# Altium schematic sheet edl_final.SchDoc
size E
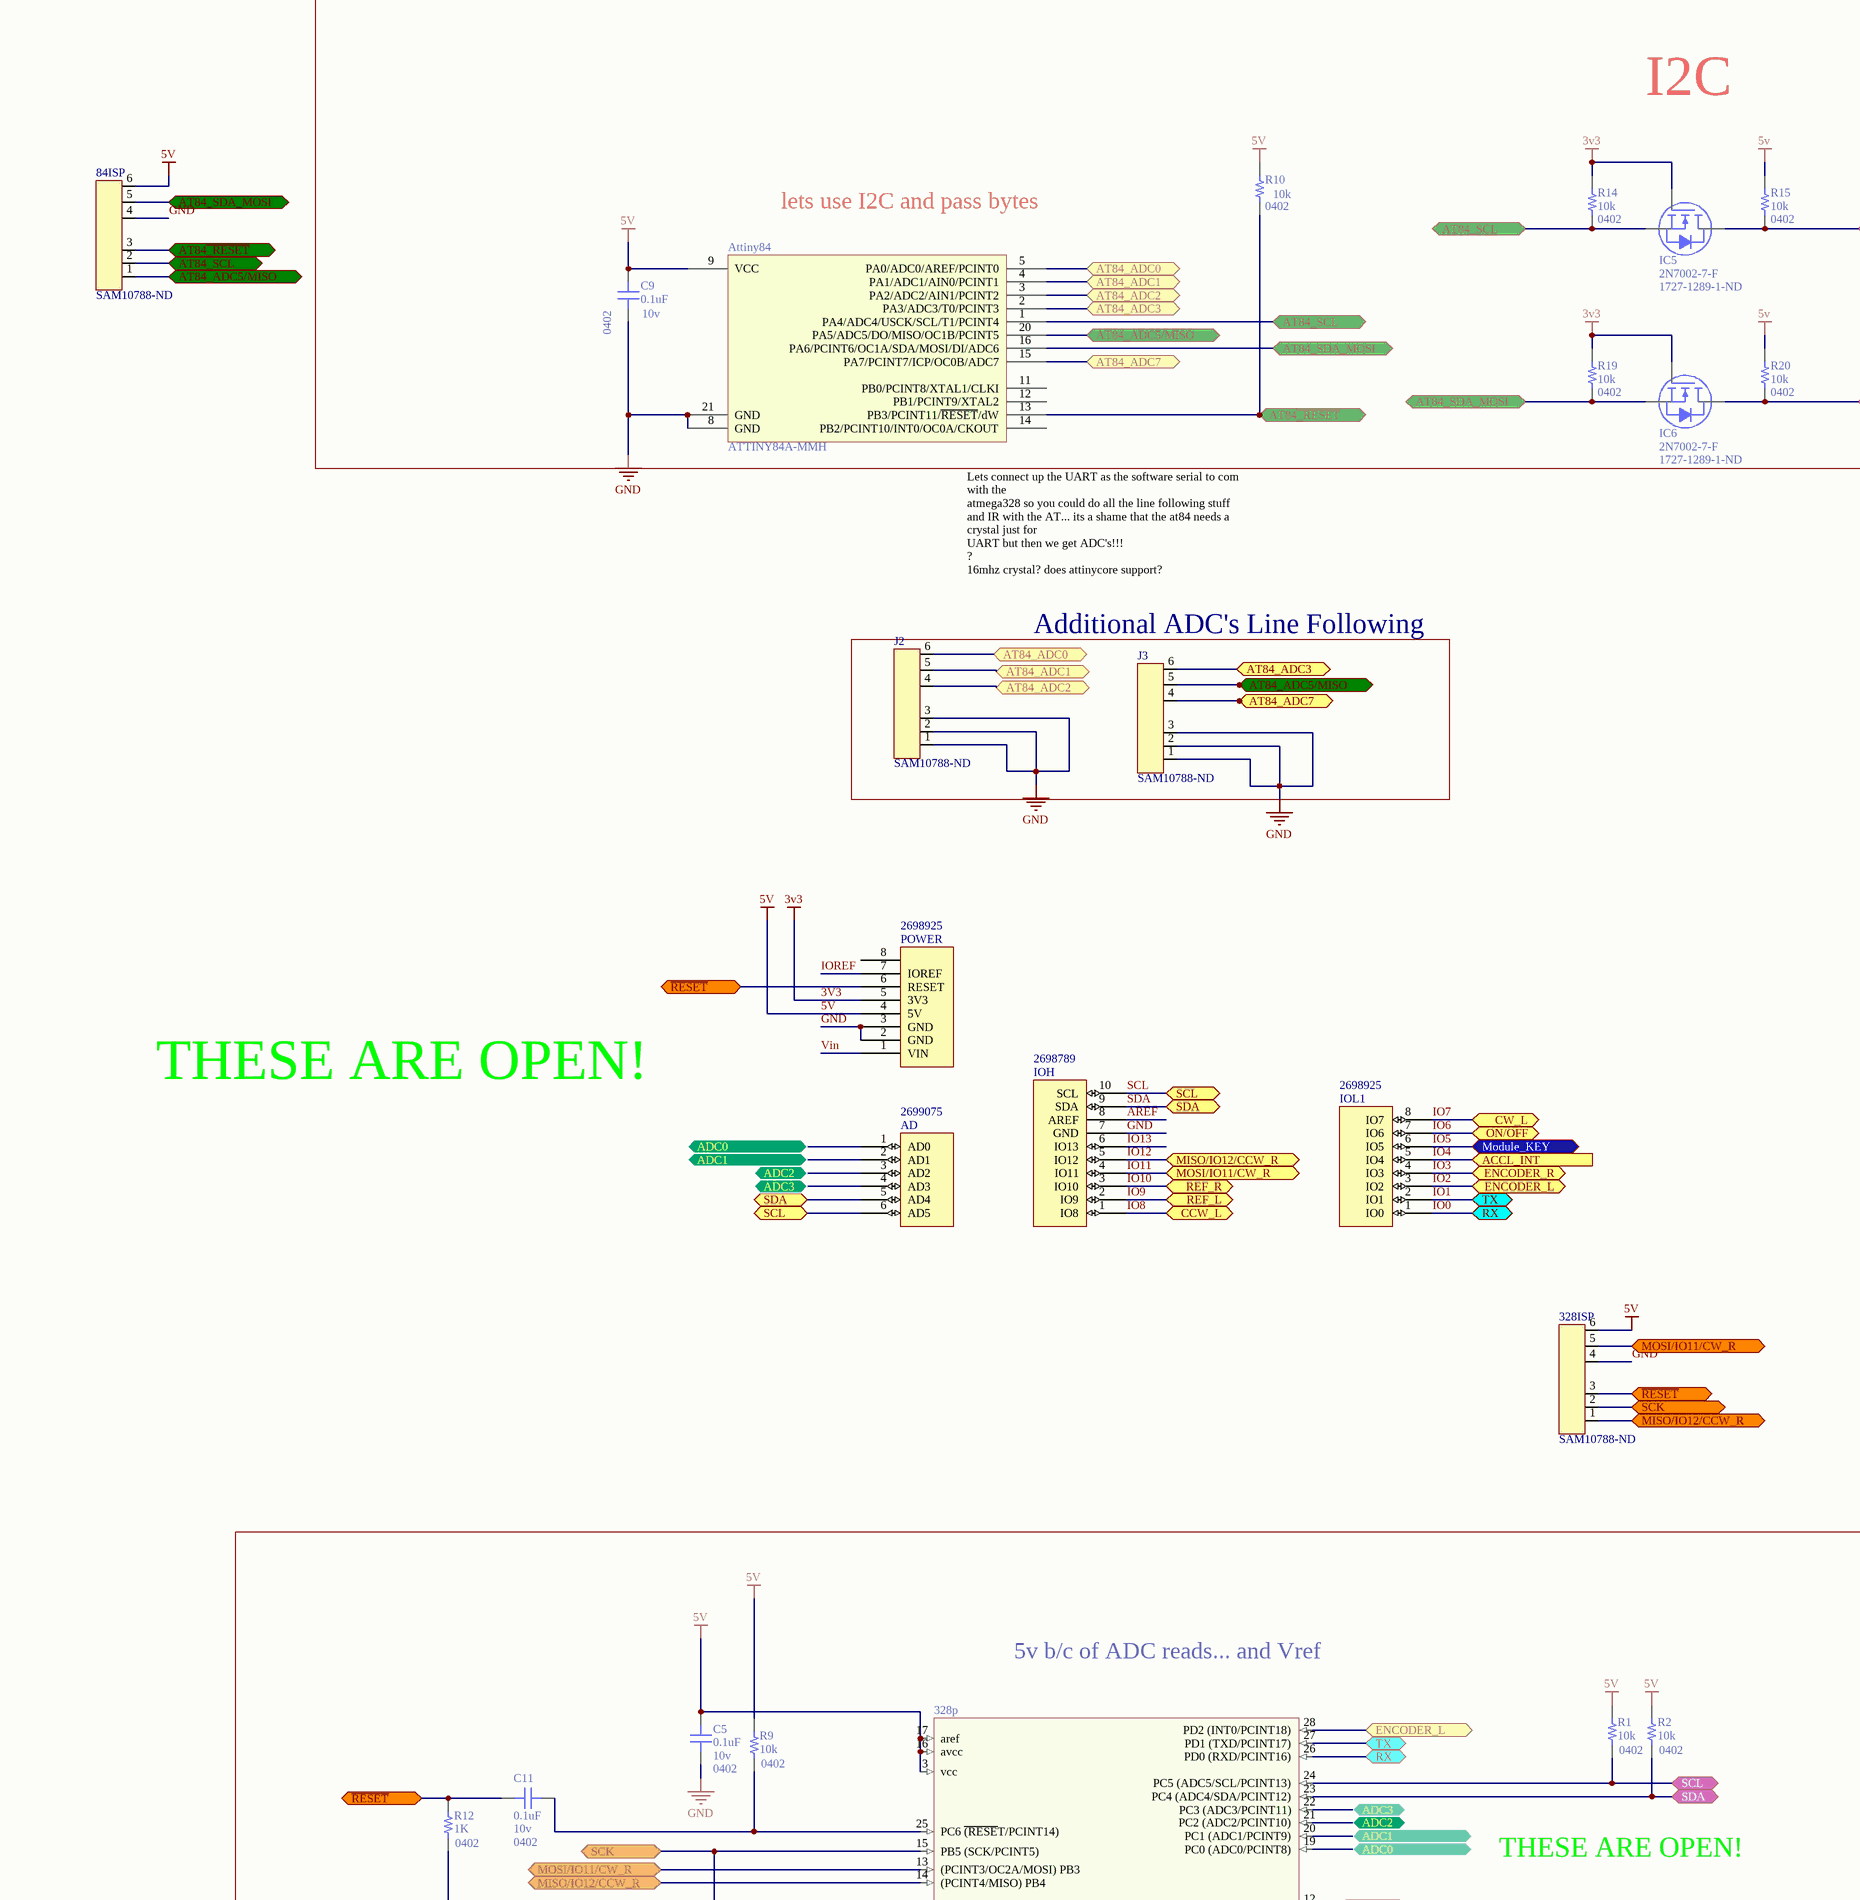
[diagram p0: edl_final.SchDoc, top left]
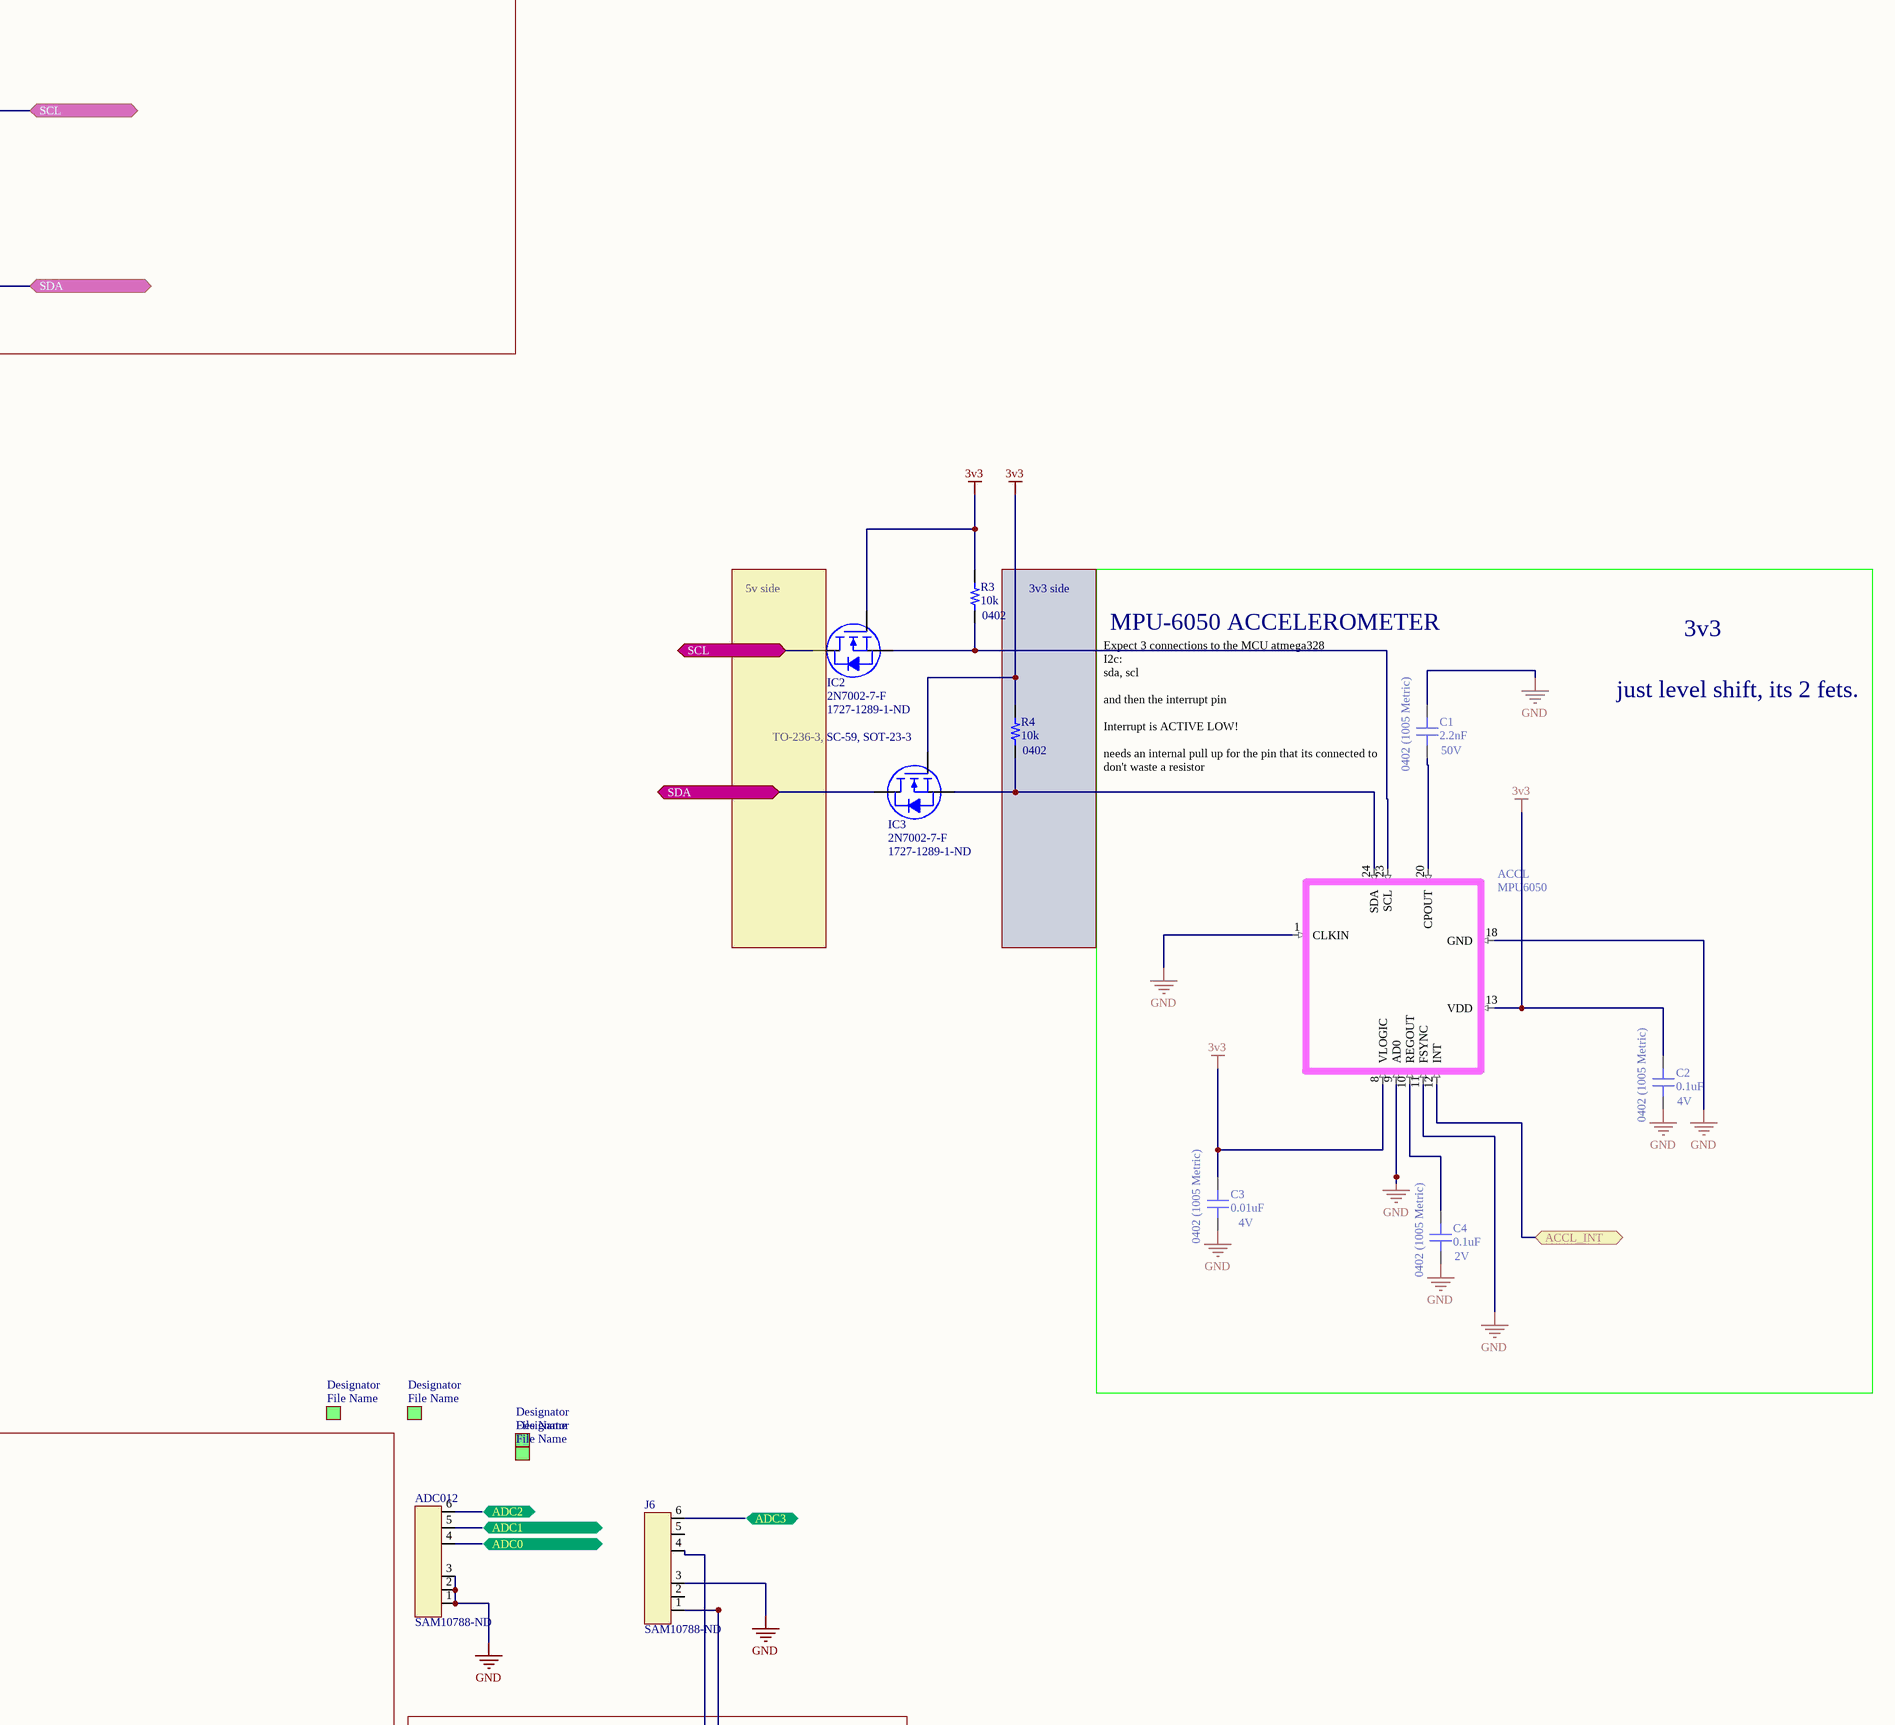
[diagram p1: edl_final.SchDoc, top middle]
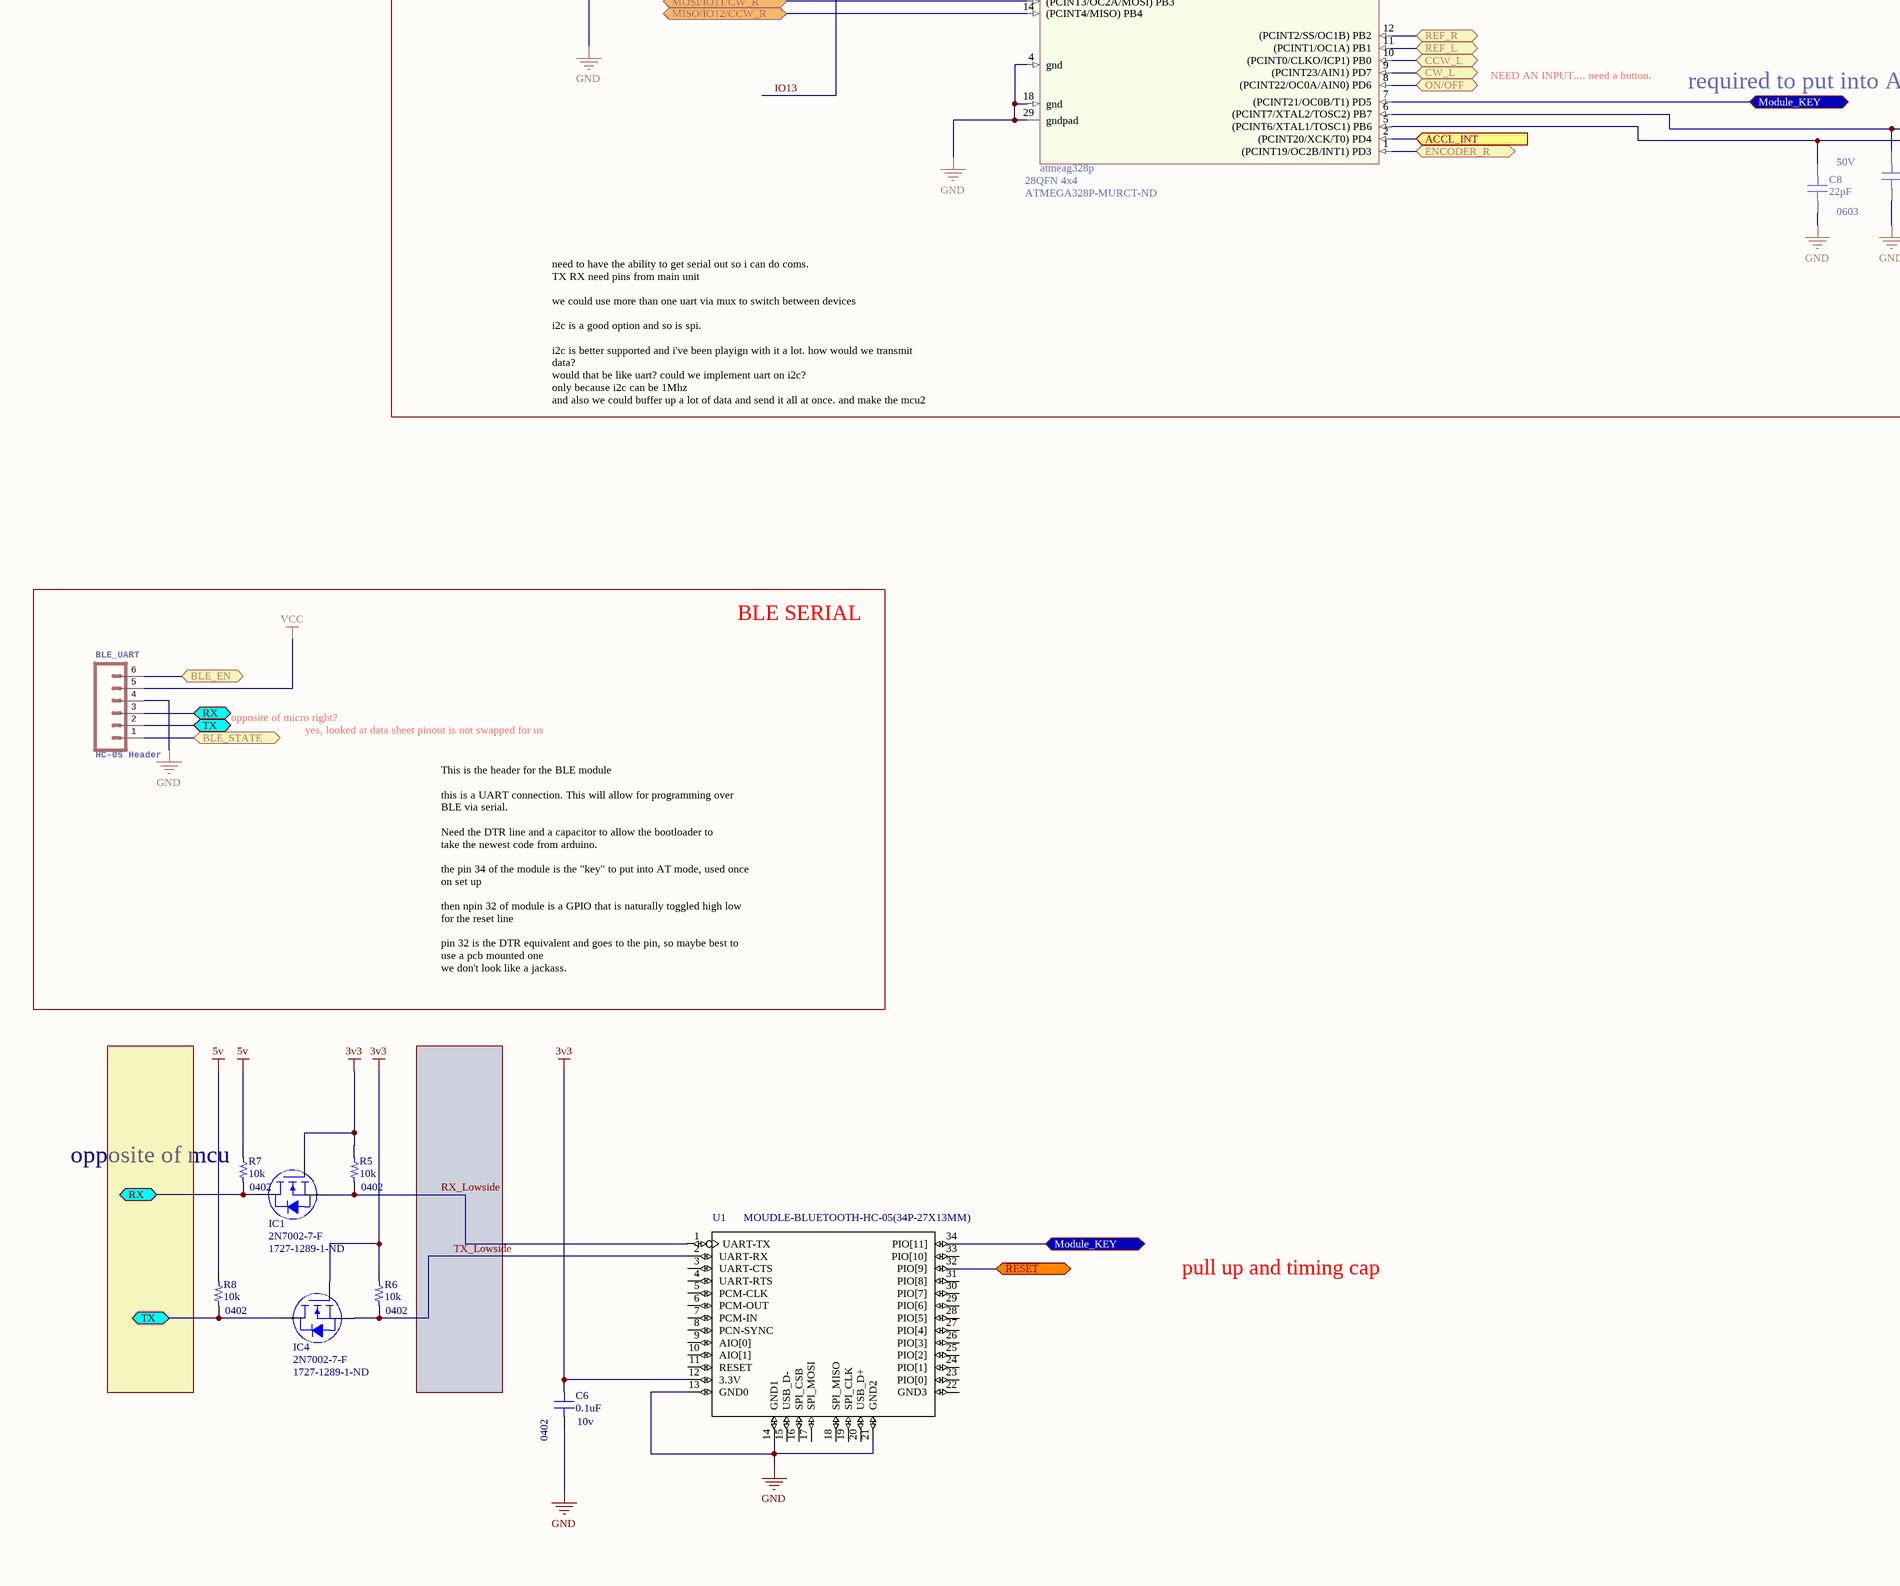
[diagram p2: edl_final.SchDoc, bottom left]
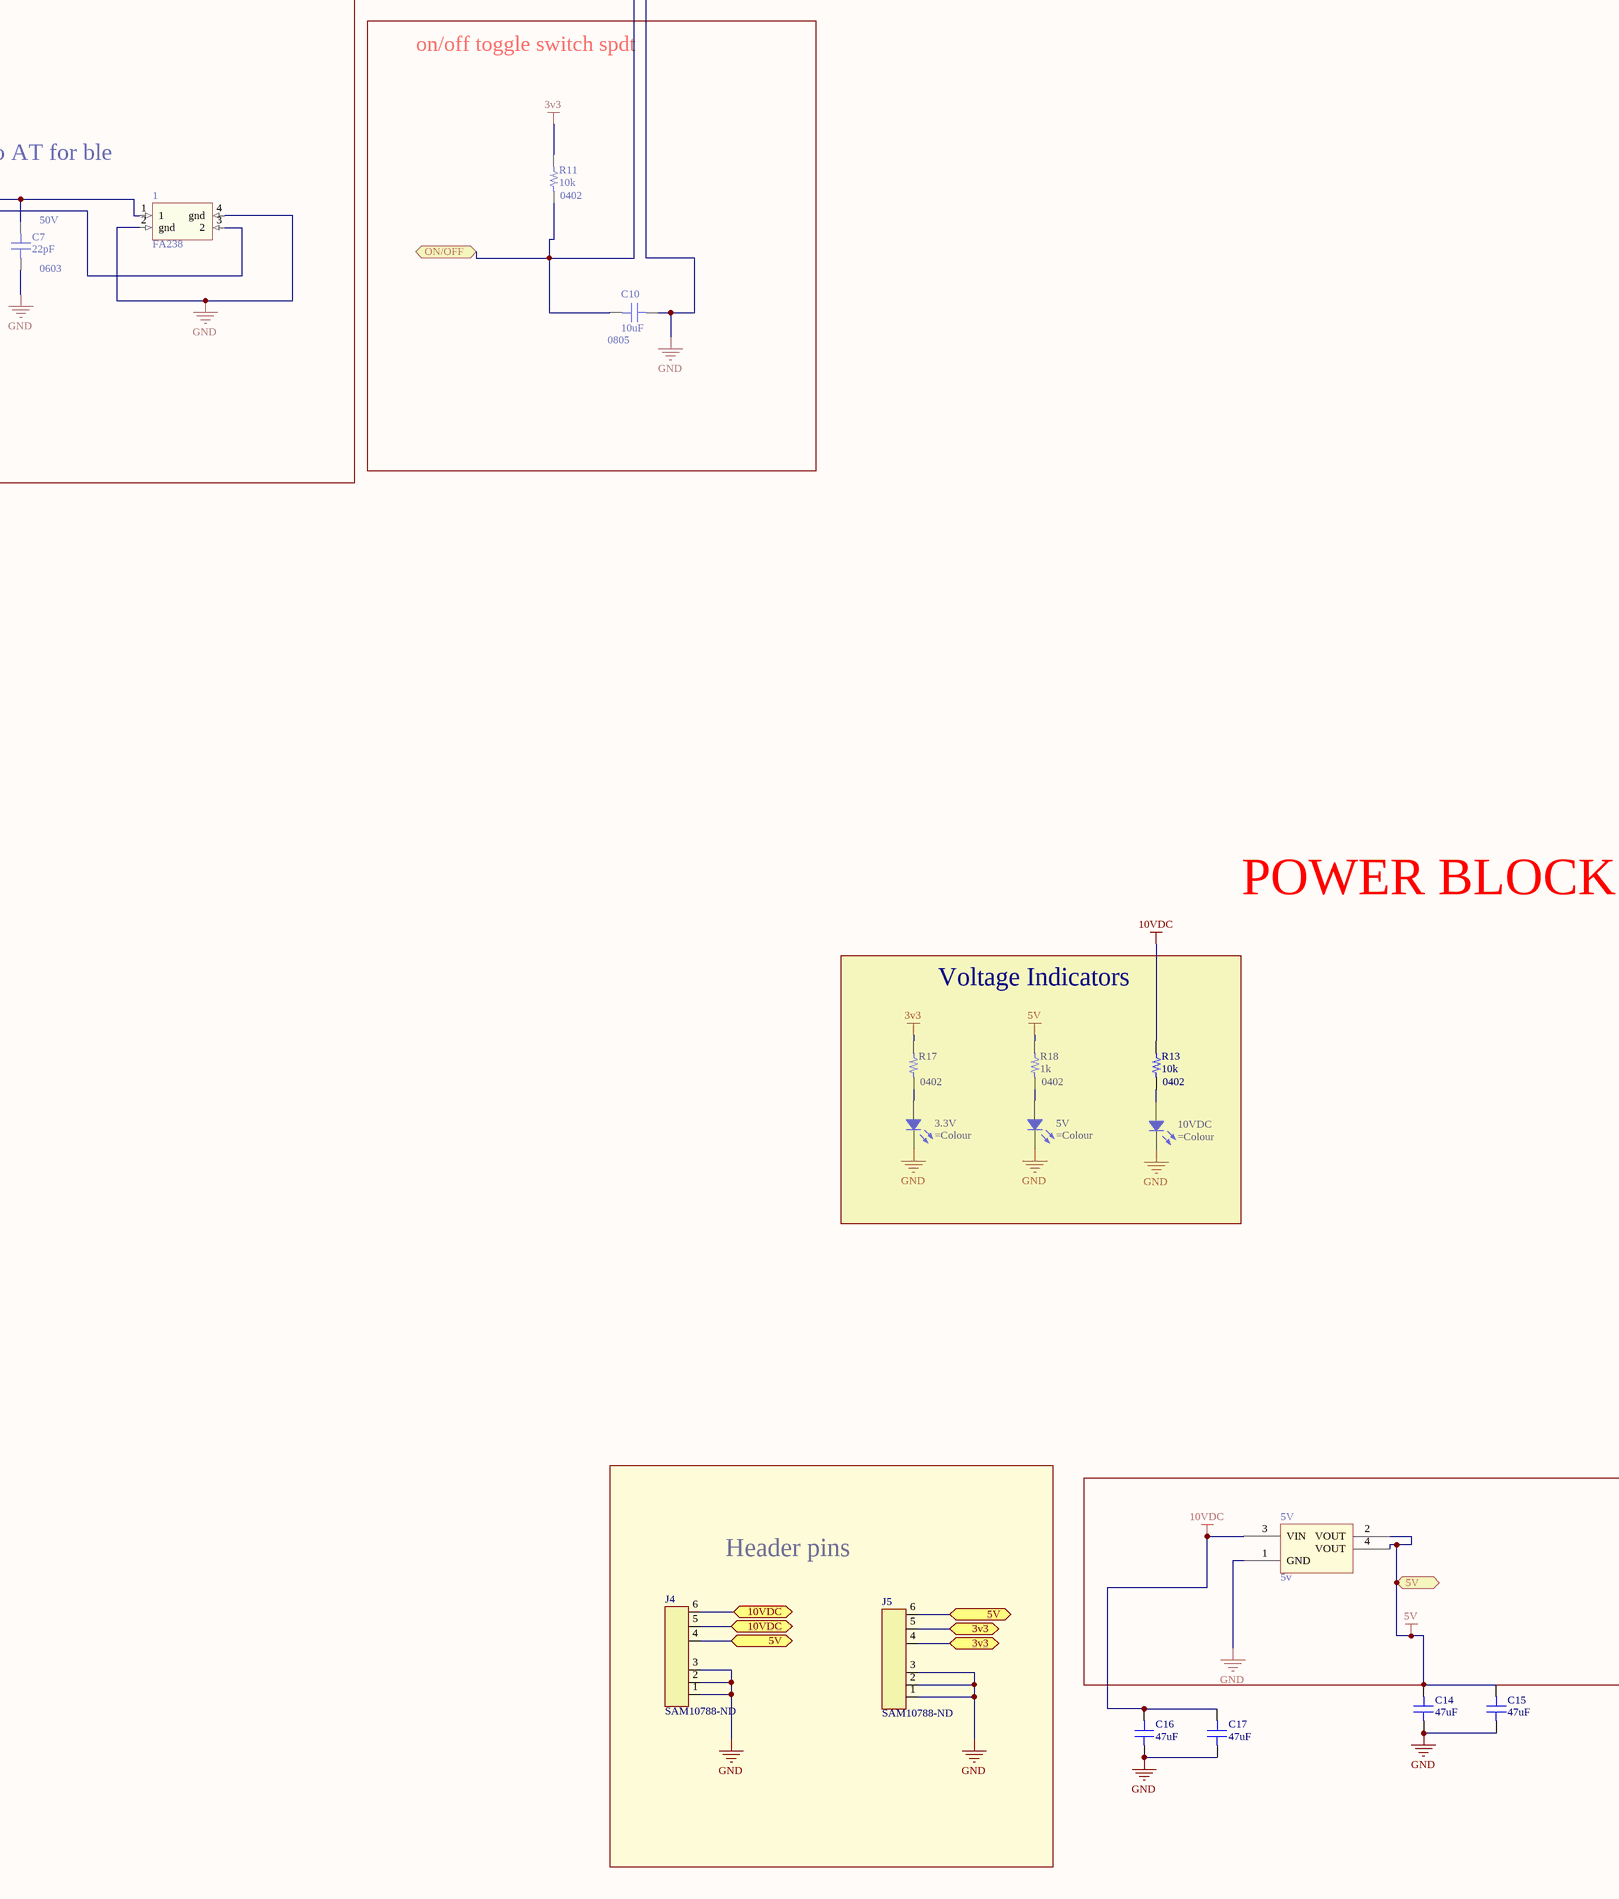
[diagram p3: edl_final.SchDoc, bottom middle]
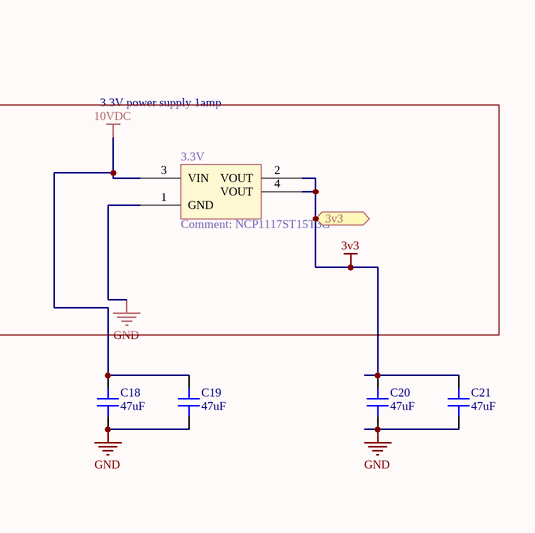
[diagram p4: edl_final.SchDoc, bottom right]

## Parts
(Parts that share a designator on the sheet are numbered #1, #2 ... from top to bottom, then left to right.)
1  FA238  [OSCCC200X160X50]
3.3V#1  (no value)  [LED 0603/1608 RED]
3.3V#2  NCP1117ST15T3G  [ON SEMI SOT-223 ST(318H)]
5V#1  (no value)  [LED 0603/1608 RED]
5V#2  5v  [ON SEMI SOT-223 ST(318H)]
10VDC  (no value)  [LED 0603/1608 RED]
84ISP  smd2x6_90*  [smd36]  (value not drawn)
328ISP  smd2x6_90*  [smd36]  (value not drawn)
328p  atmeag328p  Package: 28QFN 4x4  Digikey: ATMEGA328P-MURCT-ND  [yy]]
ACCL  MPU6050  [MPU-6050]
AD  Supplier Part Number 4: 2699075  [Header 6x1 8.5mm]  (hidden comment: AD)
ADC012  smd2x6_90*  [smd36]  (value not drawn)
Attiny84  ATTINY84A-MMH  [Atmel VQFN-20 3x3mm 20M2]
BLE_UART  HC-05 Header  [1X06_NO_SILK]
C1  2.2nF  Voltage: 50V  Device Package: 0402 (1005 Metric)  [CAP 0402/1005]
C2  0.1uF  Voltage: 4V  Device Package: 0402 (1005 Metric)  [CAP 0402/1005]
C3  0.01uF  Voltage: 4V  Device Package: 0402 (1005 Metric)  [CAP 0402/1005]
C4  0.1uF  Voltage: 2V  Device Package: 0402 (1005 Metric)  [CAP 0402/1005]
C5  0.1uF  Voltage: 10v  Device Package: 0402  [CAP 0402/1005]
C6  0.1uF  Voltage: 10v  Device Package: 0402  [CAP 0402/1005]
C7  22pF  Voltage: 50V  Device Package: 0603  [CAP 0603/1608]
C8  22pF  Voltage: 50V  Device Package: 0603  [CAP 0603/1608]
C9  0.1uF  Voltage: 10v  Device Package: 0402  [CAP 0402/1005]
C10  10uF  Package: 0805  [RES 0805/2012]
C11  0.1uF  Voltage: 10v  Device Package: 0402  [CAP 0402/1005]
C14  47uF  [CAP 0603/1608]
C15  47uF  [CAP 0603/1608]
C16  47uF  [CAP 0603/1608]
C17  47uF  [CAP 0603/1608]
C18  47uF  [CAP 0603/1608]
C19  47uF  [CAP 0603/1608]
C20  47uF  [CAP 0603/1608]
C21  47uF  [CAP 0603/1608]
IC1  2N7002-7-F  digikey: 1727-1289-1-ND  [DIODES SOT-23-3]
IC2  2N7002-7-F  Device Package: TO-236-3, SC-59, SOT-23-3  digikey: 1727-1289-1-ND  [DIODES SOT-23-3]
IC3  2N7002-7-F  digikey: 1727-1289-1-ND  [DIODES SOT-23-3]
IC4  2N7002-7-F  digikey: 1727-1289-1-ND  [DIODES SOT-23-3]
IC5  2N7002-7-F  digikey: 1727-1289-1-ND  [DIODES SOT-23-3]
IC6  2N7002-7-F  digikey: 1727-1289-1-ND  [DIODES SOT-23-3]
IOH  Supplier Part Number 3: 2698789  [Header 10x1 8.5mm]  (hidden comment: IOH)
IOL1  Supplier Part Number 4: 2698925  [Header 8x1 8.5mm]  (hidden comment: IOL)
J2  smd2x6_90*  [smd36]  (value not drawn)
J3  smd2x6_90*  [smd36]  (value not drawn)
J4  smd2x6_90*  [smd36]  (value not drawn)
J5  smd2x6_90*  [smd36]  (value not drawn)
J6  smd2x6_90*  [smd36]  (value not drawn)
POWER  Supplier Part Number 4: 2698925  [Header 8x1 8.5mm]  (hidden comment: POWER_UNO)
R1  10k  Device Package: 0402  [RES 0402/1005]
R2  10k  Device Package: 0402  [RES 0402/1005]
R3  10k  Device Package: 0402  [RES 0402/1005]
R4  10k  Device Package: 0402  [RES 0402/1005]
R5  10k  Device Package: 0402  [RES 0402/1005]
R6  10k  Device Package: 0402  [RES 0402/1005]
R7  10k  Device Package: 0402  [RES 0402/1005]
R8  10k  Device Package: 0402  [RES 0402/1005]
R9  10k  Device Package: 0402  [RES 0402/1005]
R10  10k  Device Package: 0402  [RES 0402/1005]
R11  10k  Device Package: 0402  [RES 0402/1005]
R12  1K  Device Package: 0402  [RES 0402/1005]
R13  10k  Device Package: 0402  [RES 0402/1005]
R14  10k  Device Package: 0402  [RES 0402/1005]
R15  10k  Device Package: 0402  [RES 0402/1005]
R17  Device Package: 0402  [RES 0402/1005]
R18  1k  Device Package: 0402  [RES 0402/1005]
R19  10k  Device Package: 0402  [RES 0402/1005]
R20  10k  Device Package: 0402  [RES 0402/1005]
U1  MOUDLE-BLUETOOTH-HC-05(34P-27X13MM)  [BT34P-SMD-1.5-26.9X13.0X2.2MM]

## Blocks framed on the sheet
I2C: Attiny84 C9 IC5 IC6 R10 R14 R15 R19 R20
Additional ADC's Line Following: J2 J3
3v3 side: R4
THESE ARE OPEN!: 1 328p C5 C7 C8 C11 R1 R2 R9 R12
on/off toggle switch spdt: C10 R11
BLE SERIAL: BLE_UART
Voltage Indicators: 3.3V#1 5V#1 10VDC R13 R17 R18
Header pins: J4 J5
3.3V power supply 1amp: 3.3V#2 5V#2

## Sub-sheets
Designator = File Name: no entries
Designator = File Name: no entries
Designator = File Name: no entries
Designator = File Name: no entries

## Ports
3v3, 5V, 10VDC, ACCL_INT, ACCL_INT (in), ADC0, ADC1, ADC2, ADC3, AT84_ADC0, AT84_ADC1, AT84_ADC2, AT84_ADC3, AT84_ADC5/MISO, AT84_ADC7, AT84_SCL, AT84_SDA_MOSI, AT84~{_RESET}, BLE_EN, BLE_STATE, CCW_L, CW_L, ENCODER_L, ENCODER_R, MISO/IO12/CCW_R, Module_KEY, MOSI/IO11/CW_R, ON/OFF, REF_L, REF_R, RX, SCK, SCL, SDA, TX, ~{RESET}

## Nets
3V3: 3.3V#2.2(VOUT) 3.3V#2.4(VOUT) ACCL.8(VLOGIC) ACCL.13(VDD) C2.2 C3.2 C6.2 C20.2 C21.2 IC1.1(G) IC2.1(G) IC3.1(G) IC4.1(G) IC5.1(G) IC6.1(G) J5.4 J5.5 POWER.5(3V3) R3.2 R4.2 R5.2 R6.2 R11.2 R14.2 R17.2 R19.2 U1.12(3.3V) ; port 3v3
5V: 5V#2.2(VOUT) 5V#2.4(VOUT) 84ISP.6 328ISP.6 328p.3(vcc) 328p.16(avcc) 328p.17(aref) Attiny84.9(VCC) C5.1 C9.2 C14.2 C15.2 J4.4 J5.6 POWER.4(5V) R1.2 R2.2 R7.2 R8.2 R9.2 R10.2 R15.2 R18.2 R20.2 ; port 5V
10VDC: 3.3V#2.3(VIN) 5V#2.3(VIN) C16.2 C17.2 C18.2 C19.2 R13.2
GND: 1.2(gnd) 1.4(gnd) 3.3V#1.2 3.3V#2.1(GND) 5V#1.2 5V#2.1(GND) 10VDC.2 84ISP.4 328ISP.4 328p.4(gnd) 328p.18(gnd) 328p.29(gndpad) ACCL.1(CLKIN) ACCL.9(AD0) ACCL.11(FSYNC) ACCL.18(GND) ADC012.1 ADC012.2 ADC012.3 Attiny84.8(GND) Attiny84.21(GND) BLE_UART.4 C1.2 C2.1 C3.1 C4.1 C5.2 C6.1 C7.1 C8.1 C9.1 C10.2 C14.1 C15.1 C16.1 C17.1 C18.1 C19.1 C20.1 C21.1 IOH.7(GND) J2.1 J2.2 J2.3 J3.1 J3.2 J3.3 J4.1 J4.2 J4.3 J5.1 J5.2 J5.3 J6.1 J6.3 POWER.2(GND) POWER.3(GND) R12.1 U1.13(GND0) U1.14(GND1) U1.21(GND2)
VCC: BLE_UART.5
10VDC: J4.5 J4.6 ; port 10VDC  [a separate net that carries the same name]
~{RESET}: 328ISP.3 C11.2 POWER.6(RESET) R12.2 U1.32(PIO[9]) ; port ~{RESET}
ADC0: 328p.19(PC0_(ADC0/PCINT8)) AD.1(AD0) ADC012.4 ; port ADC0
ADC1: 328p.20(PC1_(ADC1/PCINT9)) AD.2(AD1) ADC012.5 ; port ADC1
ADC2: 328p.21(PC2_(ADC2/PCINT10)) AD.3(AD2) ADC012.6 ; port ADC2
ADC3: 328p.22(PC3_(ADC3/PCINT11)) AD.4(AD3) J6.6 ; port ADC3
AREF: IOH.8(AREF)
AT84~{_RESET}: 84ISP.3 Attiny84.13(PB3/PCINT11/~{RESET}/dW) R10.1 ; port AT84~{_RESET}
AT84_ADC0: Attiny84.5(PA0/ADC0/AREF/PCINT0) J2.6 ; port AT84_ADC0
AT84_ADC1: Attiny84.4(PA1/ADC1/AIN0/PCINT1) J2.5 ; port AT84_ADC1
AT84_ADC2: Attiny84.3(PA2/ADC2/AIN1/PCINT2) J2.4 ; port AT84_ADC2
AT84_ADC3: Attiny84.2(PA3/ADC3/T0/PCINT3) J3.6 ; port AT84_ADC3
AT84_ADC5/MISO: 84ISP.1 Attiny84.20(PA5/ADC5/DO/MISO/OC1B/PCINT5) J3.5 ; port AT84_ADC5/MISO
AT84_ADC7: Attiny84.15(PA7/PCINT7/ICP/OC0B/ADC7) J3.4 ; port AT84_ADC7
AT84_SCL: 84ISP.2 Attiny84.1(PA4/ADC4/USCK/SCL/T1/PCINT4) IC5.3(S) R14.1 ; port AT84_SCL
AT84_SDA_MOSI: 84ISP.5 Attiny84.16(PA6/PCINT6/OC1A/SDA/MOSI/DI/ADC6) IC6.3(S) R19.1 ; port AT84_SDA_MOSI
BLE_EN: BLE_UART.6 ; port BLE_EN
BLE_STATE: BLE_UART.1 ; port BLE_STATE
IO0: 328p.26(PD0_(RXD/PCINT16)) BLE_UART.3 IC1.2(D) IOL1.1(IO0) R7.1 ; port RX
IO1: 328p.27(PD1_(TXD/PCINT17)) BLE_UART.2 IC4.2(D) IOL1.2(IO1) R8.1 ; port TX
IO2: 328p.28(PD2_(INT0/PCINT18)) IOL1.3(IO2) ; port ENCODER_L
IO3: 328p.1((PCINT19/OC2B/INT1)_PD3) IOL1.4(IO3) ; port ENCODER_R
IO4: 328p.2((PCINT20/XCK/T0)_PD4) ACCL.12(INT) IOL1.5(IO4) ; port ACCL_INT
IO5: 328p.7((PCINT21/OC0B/T1)_PD5) IOL1.6(IO5) U1.34(PIO[11]) ; port Module_KEY
IO6: 328p.8((PCINT22/OC0A/AIN0)_PD6) C10.1 IOL1.7(IO6) J6.4 R11.1 ; port ON/OFF
IO7: 328p.9((PCINT23/AIN1)_PD7) IOL1.8(IO7) ; port CW_L
IO8: 328p.10((PCINT0/CLKO/ICP1)_PB0) IOH.1(IO8) ; port CCW_L
IO9: 328p.11((PCINT1/OC1A)_PB1) IOH.2(IO9) ; port REF_L
IO10: 328p.12((PCINT2/SS/OC1B)_PB2) IOH.3(IO10) ; port REF_R
IO11: 328ISP.5 328p.13((PCINT3/OC2A/MOSI)_PB3) IOH.4(IO11) ; port MOSI/IO11/CW_R
IO12: 328ISP.1 328p.14((PCINT4/MISO)_PB4) IOH.5(IO12) ; port MISO/IO12/CCW_R
IO13: 328ISP.2 328p.15(PB5_(SCK/PCINT5)) IOH.6(IO13) ; port SCK
IOREF: POWER.7(IOREF)
RX_Lowside: IC1.3(S) R5.1 U1.1(UART-TX)
SCL: 328p.24(PC5_(ADC5/SCL/PCINT13)) AD.6(AD5) IC2.2(D) IC5.2(D) IOH.10(SCL) R1.1 R15.1 ; port SCL
SDA: 328p.23(PC4_(ADC4/SDA/PCINT12)) AD.5(AD4) IC3.2(D) IC6.2(D) IOH.9(SDA) R2.1 R20.1 ; port SDA
TX_Lowside: IC4.3(S) R6.1 U1.2(UART-RX)
Vin: POWER.1(VIN)
Net1_1: 1.1 328p.6((PCINT7/XTAL2/TOSC2)_PB7) C7.2
Net1_3: 1.3(2) 328p.5((PCINT6/XTAL1/TOSC1)_PB6) C8.2
Net3.3V#1_1: 3.3V#1.1 R17.1
Net5V#1_1: 5V#1.1 R18.1
Net10VDC_1: 10VDC.1 R13.1
Net328p_25: 328p.25(PC6_~{(RESE}T/PCINT14)) C11.1 R9.1
NetACCL_10: ACCL.10(REGOUT) C4.2
NetACCL_20: ACCL.20(CPOUT) C1.1
NetACCL_23: ACCL.23(SCL) IC2.3(S) R3.1
NetACCL_24: ACCL.24(SDA) IC3.3(S) R4.1

Not connected (* = marked no-connect by the designer): ACCL 2(NC) 3(NC) 4(NC) 5(NC) 6(AUX_DA) 7(AUX_CL) 14(NC) 15(NC) 16(NC) 17(NC) 19(RESV) 21(RESV) 22(RESV); Attiny84 11(PB0/PCINT8/XTAL1/CLKI) 12(PB1/PCINT9/XTAL2) 14(PB2/PCINT10/INT0/OC0A/CKOUT); J6 2 5; POWER 8; U1 3(UART-CTS) 4(UART-RTS) 5(PCM-CLK) 6(PCM-OUT) 7(PCM-IN) 8(PCN-SYNC) 9(AIO[0]) 10(AIO[1]) 11(RESET) 15(USB_D-) 16(SPI_CSB) 17(SPI_MOSI) 18(SPI_MISO) 19(SPI_CLK) 20(USB_D+) 22(GND3) 23(PIO[0]) 24(PIO[1]) 25(PIO[2]) 26(PIO[3]) 27(PIO[4]) 28(PIO[5]) 29(PIO[6]) 30(PIO[7]) 31(PIO[8]) 33(PIO[10])

## Notes on the sheet
- lets use I2C and pass bytes
- (near Attiny84) Lets connect up the UART as the software serial to com with the
  atmega328 so you could do all the line following stuff
  and IR with the AT... its a shame that the at84 needs a crystal just for
  UART but then we get ADC's!!!
  ?
  16mhz crystal? does attinycore support?
- 5v side
- MPU-6050 ACCELEROMETER
- 3v3
- just level shift, its 2 fets.
- (near C1) Expect 3 connections to the MCU atmega328
  I2c:
  sda, scl
  and then the interrupt pin
  Interrupt is ACTIVE LOW!
  needs an internal pull up for the pin that its connected to don't waste a resistor
- THESE ARE OPEN!
- 5v b/c of ADC reads... and Vref
- NEED AN INPUT.... need a button.
- required to put into AT for ble
- need to have the ability to get serial out so i can do coms.
  TX RX need pins from main unit
  we could use more than one uart via mux to switch between devices
  i2c is a good option and so is spi.
  i2c is better supported and i've been playign with it a lot. how would we transmit
  data?
  would that be like uart? could we implement uart on i2c?
  only because i2c can be 1Mhz
  and also we could buffer up a lot of data and send it all at once. and make the mcu2
  be like a remote ISR.
- opposite of micro right?
- yes, looked at data sheet pinout is not swapped for us
- POWER BLOCK 3V3 AND 5V and 10v
- This is the header for the BLE module
  this is a UART connection. This will allow for programming over BLE via serial.
  Need the DTR line and a capacitor to allow the bootloader to
  take the newest code from arduino.
  the pin 34 of the module is the "key" to put into AT mode, used once on set up
  then npin 32 of module is a GPIO that is naturally toggled high low for the reset line
  pin 32 is the DTR equivalent and goes to the pin, so maybe best to use a pcb mounted one
  we don't look like a jackass.
- (near R7) opposite of mcu
- pull up and timing cap

## Library data of the parts
1 = FA238: FA238 4 pin can crstyal
3.3V#1 5V#1 10VDC = LTST-C191KRKT: LED RED CLEAR 0603 SMD; Value: Green; Part Number: LTST-C191KRKT
3.3V#2 5V#2 = NCP1117ST15T3G: IC REG LDO 1.5V 1A SOT223; Part Number: NCP1117ST15T3G
84ISP 328ISP ADC012 J2-J6 = SAM10788-ND: 90 degree 0.1" header digkey SAM10788-ND; digikey: SAM10788-ND
328p = 328p_28QFN: 28 pin qfn, or mlf 28 pin compatible with uno
ACCL = MPU-6050: IMU ACCEL/GYRO 3-AXIS I2C 24QFN; Name: MPU6050
Attiny84 = ATTINY84A-MMH: IC MCU 8BIT 8KB FLASH 20VQFN; Manufacturer: Atmel; Core Processor: AVR; Core Size: 8-Bit; Speed: 20MHz; Number Of IO: 12; Program Memory Size: 8KB (4K x 16); EEPROM Size: 512 x 8; Data Converters: A/D 8x10b; Oscillator Type: Internal; Part Number: ATTINY84A-MMH; PartId: 9189; Supplier 1: Digi-Key; Supplier Part Number 1: ATTINY84A-MMH-ND; ComponentLink1Description: Datasheet; ComponentLink1URL: http://www.atmel.com/Images/8183s.pdf; ComponentLink2Description: Digi-Key Listing; ComponentLink2URL: https://www.digikey.com/product-detail/en/ATTINY84A-MMH/ATTINY84A-MMH-ND/3046449; Price: 1.87; Device Package: 20-VFQFN Exposed Pad; Series: AVR® ATtiny; Program Memory Type: FLASH; Ram Size: 512 x 8
BLE_UART = CONN_06NO_SILK_NO_POP
C1-C6 C9 C11 = C1005X7R1C104K050BC: CAP CER 0.1UF 16V X7R 0402; Manufacturer: TDK Corporation; TemperatureRange: -55C ~ 125C; Tolerance: 10%; Value: 0.1uF; Part Number: C1005X7R1C104K050BC; PartId: 3856; Supplier 1: Digi-Key; Supplier Part Number 1: 445-4952-2-ND; ComponentLink1Description: Datasheet; ComponentLink1URL: https://product.tdk.com/info/en/catalog/datasheets/mlcc_commercial_general_en.pdf; ComponentLink2Description: Digi-Key listing; ComponentLink2URL: http://digikey.com/product-detail/en/C1005X7R1C104K050BC/445-4952-2-ND/2093220; TemperatureCoefficient: X7R; Price: 0.0066; Type: -
C7 C8 = C1608C0G1H220J080AA: CAP CER 22PF 50V C0G 0603; Manufacturer: TDK Corporation; TemperatureRange: -55C ~ 125C; TemperatureCoefficient: C0G, NP0; Tolerance: 5%; Value: 22pF; Part Number: C1608C0G1H220J080AA; PartId: 4031; Supplier 1: Digi-Key; Supplier Part Number 1: 445-1273-1-ND; ComponentLink1Description: Datasheet; ComponentLink1URL: https://product.tdk.com/info/en/catalog/datasheets/mlcc_commercial_general_en.pdf; ComponentLink2Description: Digi-Key listing; ComponentLink2URL: http://digikey.com/product-detail/en/C1608C0G1H220J080AA/445-1273-1-ND/567670; Price: 0.14; Type: -
C10 = C2012X7R1H104K085AA: CAP CER 0.1UF 50V X7R 0805; Value: 0.1uF; Part Number: C2012X7R1H104K085AA
C14-C21 = C1608X7R1E104K080AA: CAP CER 0.1UF 25V X7R 0603; Value: 0.1uF; Part Number: C1608X7R1E104K080AA
IC1-IC6 = 2N7002-7-F: MOSFET N-CH 60V 115MA SOT23-3; Manufacturer: Diodes Incorporated; Rds On (Max) at Id, Vgs: 7.5 Ohm @ 50mA, 5V; Vgs(th) (Max) at Id: 2.5V @ 250uA; Input Capacitance (Ciss) at Vds: 50pF @ 25V; Power - Max: 370mW; Current Continuous Drain: 115mA (Ta); Part Number: 2N7002-7-F; PartId: 7967; Supplier 1: Digi-Key; Supplier Part Number 1: 2N7002-FDITR-ND; ComponentLink1Description: Datasheet; ComponentLink1URL: http://www.diodes.com/_files/datasheets/ds11303.pdf; ComponentLink2Description: Digi-Key Listing; ComponentLink2URL: http://www.digikey.com/product-detail/en/2N7002-7-F/2N7002-FDITR-ND/717681; Price: 0.0255; Type: MOSFET N-Channel, Metal Oxide; Gate Charge (Qg): -; Drain to Source Voltage (Vdss): 60V; Features: Standard
  IC1 IC3-IC6: Device Package: TO-236-3, SC-59, SOT-23-3
R1-R15 R18-R20 = ERJ-2RKF1002X: RES SMD 10K OHM 1% 1/10W 0402; Manufacturer: Panasonic Electronic Components; TemperatureRange: -55C ~ 155C; TemperatureCoefficient: 100ppm/C; PowerRating: 0.1W, 1/10W; Part Number: ERJ-2RKF1002X; PartId: 1; Supplier 1: Digi-Key; Supplier Part Number 1: P10.0KLTR-ND; ComponentLink1Description: Datasheet; ComponentLink1URL: http://industrial.panasonic.com/www-cgi/jvcr13pz.cgi?E+PZ+3+AOA0002+ERJ2RKF1002X+7+WW; ComponentLink2Description: Digikey listing; ComponentLink2URL: http://digikey.com/product-detail/en/ERJ-2RKF1002X/P10.0KLTR-ND/192073; Tolerance: 1%; Price: 0.0043; Type: Thick Film
  R1-R11 R13-R15 R19 R20: Value: 10k
  R12: Value: 1K
  R18: Value: 1k
R17 = ERJ-2RKF1002X: RES SMD 10K OHM 1% 1/10W 0402; Manufacturer: Panasonic Electronic Components; Value: 1k; TemperatureRange: -55C ~ 155C; TemperatureCoefficient: 100ppm/C; PowerRating: 0.1W, 1/10W; Part Number: ERJ-2RKF1002X; PartId: 1; Supplier 1: Digi-Key; Supplier Part Number 1: P10.0KLTR-ND; ComponentLink1Description: Datasheet; ComponentLink1URL: http://industrial.panasonic.com/www-cgi/jvcr13pz.cgi?E+PZ+3+AOA0002+ERJ2RKF1002X+7+WW; ComponentLink2Description: Digikey listing; ComponentLink2URL: http://digikey.com/product-detail/en/ERJ-2RKF1002X/P10.0KLTR-ND/192073; Tolerance: 1%; Price: 0.0043; Type: Thick Film
U1 = MOUDLE-BLUETOOTH-HC-05(34P-27X13MM): MP: HC-05; Package: SOIC-14; MF: *; Availability: Unavailable; Price: None; Value: *
AD = AD: Supplier 1: Arrow; Supplier Part Number 1: 2699089; Supplier 2: Digi-Key; Supplier Part Number 2: SAM1198-06-ND; Supplier 3: Arrow; Supplier Part Number 3: 2699088; Supplier 4: Arrow
IOH = IOH: Supplier 1: Arrow; Supplier Part Number 1: 2698803S4475693N1004; Supplier 2: Digi-Key; Supplier Part Number 2: SAM1198-10-ND; Supplier 3: Arrow
IOL1 = IOL: Supplier 1: Digi-Key; Supplier Part Number 1: SAM1198-08-ND; Supplier 2: Arrow; Supplier Part Number 2: 2698939; Supplier 3: Arrow; Supplier Part Number 3: 2698940; Supplier 4: Arrow
POWER = POWER_UNO: Supplier 1: Digi-Key; Supplier Part Number 1: SAM1198-08-ND; Supplier 2: Arrow; Supplier Part Number 2: 2698939; Supplier 3: Arrow; Supplier Part Number 3: 2698940; Supplier 4: Arrow